# EasyEDA Pro project ProDocument_PCB1_2024-05-18.epro

# Board PCB1
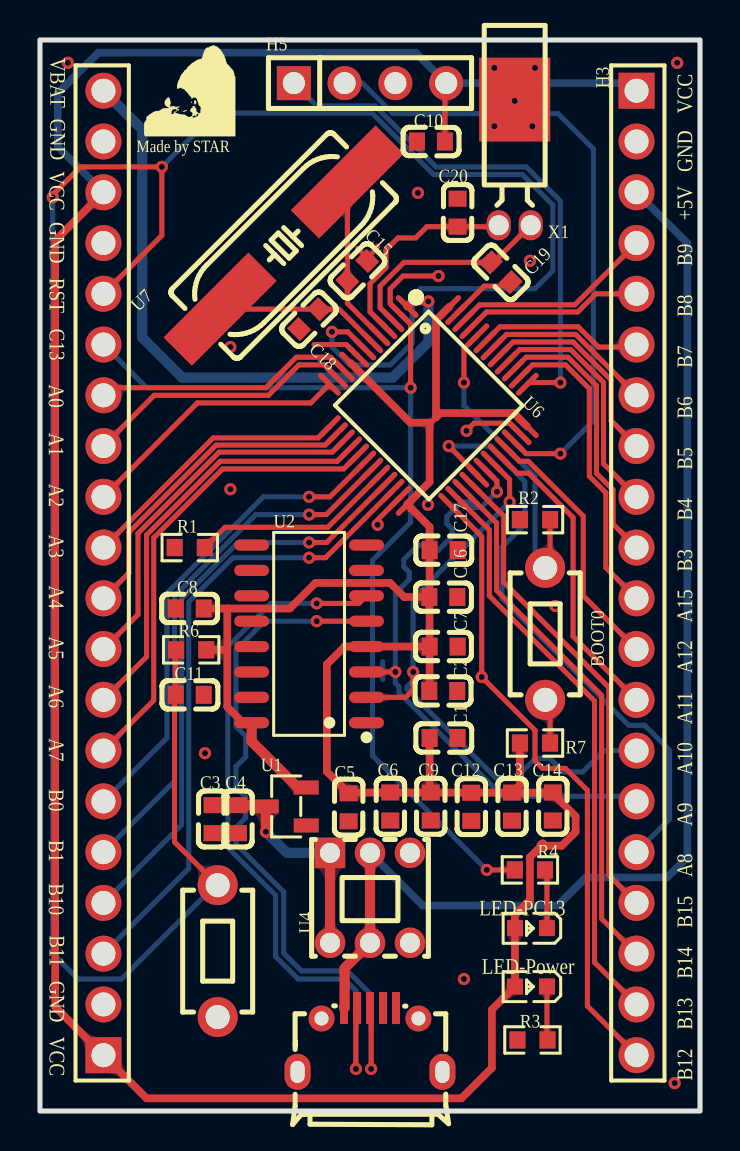
[diagram p0: board, top side]
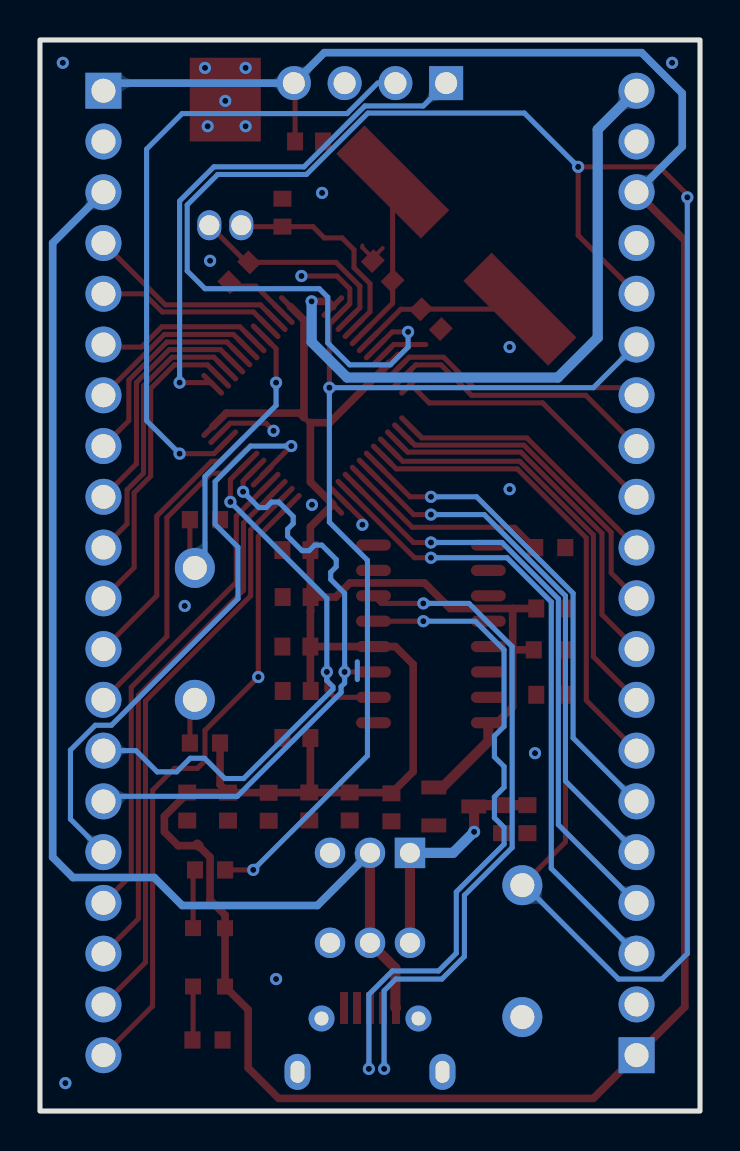
[diagram p1: board, bottom side, seen from below]

Outline 33.02 x 53.59 mm; copper layers: Top Layer, Bottom Layer. Coordinates in mm from the lower left corner of the outline.
Outline path: rectangle 0,53.59 33.02,0
Stack: Top Layer 0.035mm / Dielectric1 1.51mm FR4 er 4.5 / Bottom Layer 0.035mm

## Design rules (mm)
net PC14/RCC_OSC32_IN: DP4
net PC15/RCC_OSC32_OUT: DP4
net PD0/RCC_OSC_IN: DP3
net PD1/RCC_OSC_OUT: DP3
net PA9/MCU_USART1_TX: DP2
net PA10/MCU_USART1_RX: DP2
net $1N8327: DP1
net $1N8354: DP1
template: JLCPCB Capability(Two Layers Board)
spacing copperThickness1oz (default): track to track 0.102, other pairs 0.152 to 0.3
spacing copperThickness2oz: track to track 0.203, other pairs 0.152 to 0.3
track width copperThickness1oz (default): min 0.127, default 0.254, max 2.54
track width copperThickness2oz: min 0.203, default 0.254, max 2.54
differential pair differentialPair (default): width min 0.127, default 0.254, max 2.54; gap min 0.152, default 0.152
via viaSize (default): diameter min 0.5, default 0.61, max 10; hole min 0.3, default 0.305, max 6.3

## Placement (name value [footprint] x y rotation side)
BOOT0  YTS-B011-1A  [SW-TH_L6.1-W3.5-P6.60-LS8.0]  25.27 23.88 90 top
C1  4.7uF  [C0603]  20.19 18.67 180 top
C2  -  [C0603]  20.18 21.02 0 top
C3  10uF  [C0603]  8.64 14.61 270 top
C4  1uF  [C0603]  9.91 14.61 270 top
C5  1uF  [C0603]  15.44 15.2 270 top
C6  0.1uF  [C0603]  17.53 15.24 270 top
C7  0.1uF  [C0603]  20.19 23.24 0 top
C8  0.1uF  [C0603]  7.49 25.15 0 top
C9  -  [C0603]  19.55 15.24 270 top
C10  0.1uF  [C0603]  19.56 48.51 180 top
C11  0.1uF  [C0603]  7.49 20.83 180 top
C12  -  [C0603]  21.58 15.22 270 top
C13  -  [C0603]  23.61 15.23 270 top
C14  -  [C0603]  25.65 15.24 270 top
C15  20pF  [C0603]  15.88 42.04 225 top
C16  1uF  [C0603]  20.18 25.72 180 top
C17  0.01uF  [C0603]  20.19 28.07 180 top
C18  20pF  [C0603]  13.46 39.62 45 top
C19  8pF  [C0603]  23.05 41.97 135 top
C20  8pF  [C0603]  20.89 44.95 270 top
H3  2.54-1*20P直针  [HDR-TH_20P-P2.54-V-M-1]  29.84 26.92 270 top
H4  2.54-1*20P直针  [HDR-TH_20P-P2.54-V-M-1]  3.18 26.92 90 top
H5  PZ254V-11-04P  [HDR-TH_4P-P2.54-V-M]  16.51 51.44 0 top
NOREF  -  [Pad_e86686]  23.75 50.61 0 top
R1  10K  [R0603]  7.49 28.19 0 top
R2  10K  [R0603]  24.76 29.59 180 top
R3  660R  [R0603]  24.64 3.56 180 top
R4  660R  [R0603]  24.51 12.06 180 top
R6  10K  [R0603]  7.56 23.08 180 top
R7  10K  [R0603]  24.76 18.42 180 top
U1  XC6206P332MR  [SOT-23-3_L2.9-W1.3-P1.90-LS2.4-BR]  12.32 15.24 0 top
U2  CH340C  [SOP-16_L10.0-W3.9-P1.27-LS6.0-BL]  13.46 23.88 90 top
U3  USB-micro  [MICRO-USB-SMD_MICROXNJ]  16.51 3.56 0 top
U4  5.8 ZSGT  [SW-TH_5.8ZSGT]  16.51 10.67 180 top
U5  Reset  [SW-TH_L6.1-W3.5-P6.60-LS8.0]  8.89 8 270 top
U6  STM32F103C8T6  [LQFP-48_L7.0-W7.0-P0.50-LS9.0-BL]  19.43 35.31 225 top
U7  8MHz  [HC-49SMD_L11.1-W4.8]  12.19 43.31 45 top
U8  LED_POWER  [LED_0603]  24.51 6.22 180 top
U9  LED_PC13  [LED_0603]  24.51 9.14 180 top
X1  32.768kHz  [OSC-TH_BD3.8-P0.50]  23.75 44.32 0 top

## Footprints (pads in the part's own frame, mm; a bottom-side part is the same pattern mirrored in y, then rotated)
C0603
  rect 0.8x0.9 smd: 1(-0.7,0) 2(0.7,0)
HC-49SMD_L11.1-W4.8
  rect 6x2 smd: 1(-4.5,0) 2(4.5,0)
HDR-TH_4P-P2.54-V-M
  rect 1.7x1.7 hole 1.1: 1(-3.81,0)
  round 1.7 hole 1.1: 2(-1.27,0) 3(1.27,0) 4(3.81,0)
HDR-TH_20P-P2.54-V-M-1
  rect 1.8x1.8 hole 1.2: 1(-24.13,0)
  round 1.8 hole 1.2: 2(-21.59,0) 3(-19.05,0) 4(-16.51,0) 5(-13.97,0) 6(-11.43,0) 7(-8.89,0) 8(-6.35,0) 9(-3.81,0) 10(-1.27,0) 11(1.27,0) 12(3.81,0) 13(6.35,0) 14(8.89,0) 15(11.43,0) 16(13.97,0) 17(16.51,0) 18(19.05,0) 19(21.59,0) 20(24.13,0)
LED_0603
  rect 0.8x0.8 smd: 1(-0.851,-0.01) 2(0.75,-0.005)
LQFP-48_L7.0-W7.0-P0.50-LS9.0-BL
  oval 0.27x1.5 smd: 1(-2.75,-4.25) 2(-2.25,-4.25) 3(-1.75,-4.25) 4(-1.25,-4.25) 5(-0.75,-4.25) 6(-0.25,-4.25) 7(0.25,-4.25) 8(0.75,-4.25) 9(1.25,-4.25) 10(1.75,-4.25) 11(2.25,-4.25) 12(2.75,-4.25) 25(2.75,4.25) 26(2.25,4.25) 27(1.75,4.25) 28(1.25,4.25) 29(0.75,4.25) 30(0.25,4.25) 31(-0.25,4.25) 32(-0.75,4.25) 33(-1.25,4.25) 34(-1.75,4.25) 35(-2.25,4.25) 36(-2.75,4.25)
  oval 1.5x0.27 smd: 13(4.25,-2.75) 14(4.25,-2.25) 15(4.25,-1.75) 16(4.25,-1.25) 17(4.25,-0.75) 18(4.25,-0.25) 19(4.25,0.25) 20(4.25,0.75) 21(4.25,1.25) 22(4.25,1.75) 23(4.25,2.25) 24(4.25,2.75) 37(-4.25,2.75) 38(-4.25,2.25) 39(-4.25,1.75) 40(-4.25,1.25) 41(-4.25,0.75) 42(-4.25,0.25) 43(-4.25,-0.25) 44(-4.25,-0.75) 45(-4.25,-1.25) 46(-4.25,-1.75) 47(-4.25,-2.25) 48(-4.25,-2.75)
MICRO-USB-SMD_MICROXNJ
  rect 0.4x1.6 smd: 1(-1.3,1.597) 2(-0.65,1.597) 3(0,1.597) 4(0.65,1.597) 5(1.3,1.597)
  round 1.3 hole 0.7: 6(2.425,1.074) 9(-2.425,1.073)
  oval 1.3x1.8 hole 0.7x1.1: 7(3.625,-1.597) 8(-3.625,-1.597)
OSC-TH_BD3.8-P0.50
  oval 1.2x1.5 hole 1: 1(-0.8,0) 2(0.8,0)
Pad_e86686
  custom 3.556x4.191 smd: 49(0,0)
R0603
  rect 0.806x0.864 smd: 1(-0.753,0) 2(0.753,0)
SOP-16_L10.0-W3.9-P1.27-LS6.0-BL
  oval 0.56x1.745 smd: 1(-4.445,-2.873) 2(-3.175,-2.873) 3(-1.905,-2.873) 4(-0.635,-2.873) 5(0.635,-2.873) 6(1.905,-2.873) 7(3.175,-2.873) 8(4.445,-2.873) 9(4.445,2.873) 10(3.175,2.873) 11(1.905,2.873) 12(0.635,2.873) 13(-0.635,2.873) 14(-1.905,2.873) 15(-3.175,2.873) 16(-4.445,2.873)
SOT-23-3_L2.9-W1.3-P1.90-LS2.4-BR
  rect 1.25x0.7 smd: 1(1,-0.95) 2(1,0.95) 3(-1,0)
SW-TH_5.8ZSGT
  rect 1.524x1.524 hole 1: 1(2,-2.25)
  round 1.524 hole 1: 2(0,-2.25) 3(-2,-2.25) 4(2,2.25) 5(0,2.25) 6(-2,2.25)
SW-TH_L6.1-W3.5-P6.60-LS8.0
  round 2 hole 1.2: 1(-3.3,0) 2(3.3,0)

## Nets
+5V: H3.3 U3.1 U4.2 U4.5
GND: C1.1 C2.2 C3.2 C4.2 C5.2 C6.2 C7.2 C8.1 C9.2 C10.2 C11.1 C12.2 C13.2 C14.2 C15.1 C16.1 C17.1 C18.1 C19.1 C20.1 H3.2 H4.2 H4.17 H4.19 H5.3 NOREF.49 R1.1 R2.2 R3.2 U1.1 U2.1 U3.4 U3.5 U5.2 U6.8 U6.23 U6.35 U6.47
VBAT: H4.20 U6.1
VCC: C1.2 C2.1 C5.1 C6.1 C7.1 C8.2 C9.1 C10.1 C12.1 C13.1 C14.1 C16.2 C17.2 H3.1 H4.1 H4.18 H5.4 R6.1 R7.2 U1.2 U2.4 U2.16 U6.9 U6.24 U6.36 U6.48 U8.2 U9.2
BOOT0: BOOT0.2 R2.1 U6.44
NRST: C11.2 H4.16 R6.2 U5.1 U6.7
PA0: H4.14 U6.10
PA1: H4.13 U6.11
PA2: H4.12 U6.12
PA3: H4.11 U6.13
PA4: H4.10 U6.14
PA5: H4.9 U6.15
PA6: H4.8 U6.16
PA7: H4.7 U6.17
PA8: H3.16 U6.29
PA9/MCU_USART1_TX: H3.15 U2.3 U6.30
PA10/MCU_USART1_RX: H3.14 U2.2 U6.31
PA11: H3.13 U6.32
PA12: H3.12 U6.33
PA13/JTMS/SWDIO: H5.2 U6.34
PA14/JTCK/SWCLK: H5.1 U6.37
PA15: H3.11 U6.38
PB0: H4.6 U6.18
PB1: H4.5 U6.19
PB2/BOOT1: R1.2 U6.20
PB3: H3.10 U6.39
PB4: H3.9 U6.40
PB5: H3.8 U6.41
PB6: H3.7 U6.42
PB7: H3.6 U6.43
PB8: H3.5 U6.45
PB9: H3.4 U6.46
PB10: H4.4 U6.21
PB11: H4.3 U6.22
PB12: H3.20 U6.25
PB13: H3.19 U6.26
PB14: H3.18 U6.27
PB15: H3.17 U6.28
PC13/LED(B): H4.15 R4.2 U6.2
PC14/RCC_OSC32_IN: C19.2 U6.3 X1.2
PC15/RCC_OSC32_OUT: C20.2 U6.4 X1.1
PD0/RCC_OSC_IN: C15.2 U6.5 U7.2
PD1/RCC_OSC_OUT: C18.2 U6.6 U7.1
$1N7601: R3.1 U8.1
$1N7627: R4.1 U9.1
$1N8327: U2.5 U3.3
$1N8354: U2.6 U3.2
$1N13397: BOOT0.1 R7.1
$1N13854: C3.1 C4.1 U1.3 U4.1 U4.4

Pads without a net: U2 7 8 9 10 11 12 13 14 15; U3 6 7 8 9; U4 3 6

## Via types
v1: diameter 0.61, hole 0.305, Top Layer to Bottom Layer, 43 vias

## Routing (per net, layer and track width the routed paths; a pad name or vN(x,y) marks a point on that pad's centre or on a via; arc(x,y) is an arc through that point)
+5V: length 60.6
  Top Layer w0.508: U4.2 U4.5 15.24,7.15 15.24,5.18 U3.1
  Bottom Layer w0.381: H3.3 32.38,43.43 32.38,12.7 31.37,11.68 27.31,11.68 25.91,10.29 19.14,10.29 U4.2
GND: length 13.3
  Top Layer w0.203: 16.37,42.69 15.88,43.18 ; 16.37,42.69 16.89,43.21 16.89,43.31 ; 16.37,42.69 C15.1
  Top Layer w0.254: U6.35 23.5,34.42 21.72,34.42 v1(21.34,34.04) ; U6.23 16.89,29.58 v1(16.89,29.34) ; 20.84,39.9 22.22,41.28 23.34,41.28 23.55,41.48 ; 13.72,38.35 15.32,38.35 U6.8
  Bottom Layer w0.254: 17.15,22.48 17.15,21.59
  vias: v1(1.4,52.45) v1(8.25,17.91) v1(9.53,38.23) v1(9.53,31.11) v1(18.91,45.94) v1(19.41,30.34) v1(21.21,6.6) v1(22.73,52.2) v1(22.73,49.28) v1(23.75,50.55) v1(24.51,42.55) v1(24.63,49.28) v1(24.76,52.2) v1(25.78,25.27) v1(31.75,1.4) v1(31.88,52.45)
VBAT: length 32.2
  Top Layer w0.381: v1(19.43,40.51) 18.63,40.51 U6.1
  Bottom Layer w0.508: H4.20 5.12,49.11 5.12,38.7 7.11,36.7 17.65,36.7 19.43,38.48 v1(19.43,40.51)
VCC: length 205.3
  Top Layer w0.254: 19.49,34.45 19.56,34.45 19.81,34.7 ; H5.4 20.26,51.37 20.26,48.51
  Top Layer w0.381: C9.1 19.49,16 19.49,18.67 ; 9.37,23.09 9.37,20.22 10.16,19.43 U2.16 ; 9.37,23.09 9.36,23.08 R6.1 ; 9.37,23.09 9.37,25.12 ; U6.48 19.81,39.58 19.81,34.7 20.03,34.92 23.7,34.92 U6.36 ; 25.65,15.93 25.65,15.93 25.65,15.89 26.8,14.75 26.8,13.97 26.1,13.28 25.09,13.28 24.51,12.7 24.51,10.56 23.76,9.81 U9.2 U8.2 22.61,5.07 22.61,2.16 21.08,0.63 5.33,0.63 H4.1 0.76,5.21 0.76,43.56 H4.18 ; 25.65,15.93 23.61,15.93 24.01,16.33 R7.2 ; 25.65,15.93 C14.1 ; 9.37,25.12 9.35,25.15 8.19,25.15 ; 9.37,25.12 9.39,25.15 12.5,25.15 13.78,26.42 17.52,26.42 18.22,25.72 C16.2 19.49,25.73 19.49,29.23 U6.24 19.49,31.48 19.49,34.45 19.49,34.44 18.52,34.44 U6.9 ; 19.48,25.72 19.48,25.01 19.49,25 19.49,23.24 ; 19.49,23.24 U2.4 15.24,23.24 14.35,22.35 14.35,16.99 C5.1 15.47,15.93 23.61,15.93 ; 19.49,23.24 19.49,21.03 C2.1
  Top Layer w0.508: 25.09,13.28 25.15,13.33 ; U2.16 10.59,18.49 12.89,16.19 U1.2
  Bottom Layer w0.381: H4.18 0.89,48.26 0.89,50.93 2.92,52.96 18.8,52.96 H5.4 29.46,51.44 H3.1
BOOT0: length 16.2
  Top Layer w0.254: BOOT0.2 25.52,27.42 R2.1 ; v1(21.21,36.45) 21.21,38.15 21.91,38.84
  Bottom Layer w0.254: v1(21.21,36.45) 21.21,35.31 24.76,31.75 24.76,27.68 BOOT0.2
NRST: length 118.3
  Top Layer w0.254: H4.16 6.1,43.81 v1(6.1,47.24) 2.03,47.24 0.63,45.85 v1(0.63,45.72) ; v1(14.6,38.99) 15.39,38.99 16.25,38.13 ; R6.2 6.79,23.06 C11.2 6.73,20.77 6.73,13.46 U5.1
  Bottom Layer w0.254: v1(6.1,47.24) 8.79,49.94 16.62,49.94 19.69,46.86 24.13,46.86 25.65,45.34 25.65,42.04 24.76,41.15 19.05,41.15 18.62,40.72 18.62,38.44 17.53,37.34 15.49,37.34 14.6,38.23 v1(14.6,38.99) ; U5.1 8.77,11.3 4.08,6.6 1.9,6.6 0.63,7.87 v1(0.63,45.72)
PA0: length 13.1
  Top Layer w0.254: H4.14 3.56,36.19 11.31,36.19 12.83,37.72 14.54,37.72 U6.10
PA1: length 13.6
  Top Layer w0.254: H4.13 5.72,35.81 11.43,35.81 12.96,37.34 14.22,37.34 14.84,36.72
PA2: length 13.6
  Top Layer w0.254: H4.12 7.87,35.43 13.55,35.43 14.48,36.37
PA3: length 13.8
  Top Layer w0.254: H4.11 8.66,33.68 13.92,33.68 U6.13
PA4: length 16.3
  Top Layer w0.254: H4.10 4.44,26.92 4.44,28.96 8.81,33.32 14.27,33.33 14.84,33.89
PA5: length 18.7
  Top Layer w0.254: U6.15 14.62,32.97 8.96,32.97 4.9,28.91 4.9,24.84 H4.9
PA6: length 21.2
  Top Layer w0.254: H4.8 5.33,22.73 5.33,28.83 9.02,32.51 14.87,32.51 U6.16
PA7: length 23.6
  Top Layer w0.254: U6.17 15.19,32.13 9.14,32.13 5.69,28.68 5.69,20.55 H4.7
PA8: length 30.3
  Top Layer w0.254: v1(20.45,33.27) 21.91,31.82 21.91,31.77
  Bottom Layer w0.254: v1(20.45,33.27) 22.48,33.27 24.26,31.5 24.26,29.36 23.11,28.21 23.11,25.64 29.45,19.3 30.25,19.3 31.5,18.06 31.5,14.61 H3.16
PA9/MCU_USART1_TX: length 31.7
  Top Layer w0.254: v1(22.86,30.99) 22.86,31.52 U6.30 ; v1(17.78,21.97) U2.3
  Bottom Layer w0.254: v1(22.86,30.99) 22.07,30.2 21.71,30.2 21.43,30.47 21.07,30.47 20.35,29.75 20.35,29.39 20.63,29.12 20.63,28.76 19.91,28.04 19.55,28.04 19.28,28.32 18.92,28.32 18.2,27.6 18.2,27.24 18.48,26.96 18.48,26.6 17.78,25.91 v1(17.78,21.97) 17.78,21.41 17.96,21.23 17.96,20.94 23.15,15.75 29.75,15.75 29.84,15.66 H3.15
PA10/MCU_USART1_RX: length 31.7
  Top Layer w0.254: v1(18.67,21.97) 18.67,21.08 18.29,20.7 16.33,20.7 ; 22.61,32.48 23.5,31.59 v1(23.5,30.48)
  Bottom Layer w0.254: H3.14 28.22,18.03 27.15,16.97 26.19,16.97 25.5,17.65 24.79,17.65 23.77,16.64 22.83,16.64 18.36,21.11 18.36,21.23 18.67,21.54 v1(18.67,21.97) 18.67,25.65 v1(23.5,30.48)
PA11: length 15.4
  Top Layer w0.254: U6.32 23.88,31.92 24.45,31.92 26.67,29.69 26.67,23.75 H3.13
PA12: length 13
  Top Layer w0.254: H3.12 27.18,25.78 27.18,29.77 24.43,32.51 23.99,32.51 U6.33
PA13/JTMS/SWDIO: length 32.4
  Top Layer w0.254: v1(26.03,32.89) 24.32,32.89 U6.34
  Bottom Layer w0.254: v1(26.03,32.89) 27.69,34.54 27.69,48.13 25.91,49.91 17.65,49.91 16.13,51.44 H5.2
PA14/JTCK/SWCLK: length 26.6
  Top Layer w0.254: 24.38,36.37 24.46,36.45 v1(26.03,36.45)
  Bottom Layer w0.254: v1(26.03,36.45) 26.03,45.53 24.32,47.24 19.81,47.24 16.76,50.29 13.84,50.29 H5.1
PA15: length 15.7
  Top Layer w0.254: H3.11 28.31,27.19 28.31,30.94 27.48,31.77 27.48,36.15 26.29,37.34 24.65,37.34 U6.38
PB0: length 24.3
  Top Layer w0.254: 16.25,32.48 14.51,30.73 v1(13.46,30.73)
  Bottom Layer w0.254: H4.6 6.35,18.67 6.35,25.91 11.18,30.73 v1(13.46,30.73)
PB1: length 26.8
  Top Layer w0.254: U6.19 14.32,29.84 v1(13.46,29.84)
  Bottom Layer w0.254: H4.5 6.73,16.51 6.73,25.78 10.79,29.84 v1(13.46,29.84)
PB2/BOOT1: length 10.2
  Top Layer w0.254: R1.2 9.26,29.21 14.4,29.21 U6.20
PB3: length 14
  Top Layer w0.254: H3.10 28.67,29.37 28.67,31.09 27.84,31.91 27.84,36.3 26.42,37.72 24.32,37.72 23.67,37.07
PB4: length 12.2
  Top Layer w0.254: U6.40 23.99,38.1 26.55,38.1 28.19,36.45 28.19,32.39 H3.9
PB5: length 10.5
  Top Layer w0.254: H3.8 28.57,34.54 28.57,36.58 26.67,38.48 23.67,38.48 U6.41
PB6: length 8.8
  Top Layer w0.254: 22.61,38.14 23.34,38.86 26.8,38.86 H3.7
PB7: length 8.4
  Top Layer w0.254: U6.43 23.01,39.24 26.92,39.24 27.94,38.23 29.72,38.23 H3.6
PB8: length 9
  Top Layer w0.254: H3.5 27.81,40.89 26.9,39.98 22.34,39.98 U6.45
PB9: length 10.3
  Top Layer w0.254: 21.2,39.55 21.99,40.34 26.75,40.34 H3.4
PB10: length 29.5
  Top Layer w0.254: v1(13.46,28.45) 14.34,28.45 U6.21
  Bottom Layer w0.254: H4.4 7.09,14.33 7.09,25.63 9.91,28.45 v1(13.46,28.45)
PB11: length 31.9
  Top Layer w0.254: U6.22 14.28,27.69 v1(13.46,27.69)
  Bottom Layer w0.254: H4.3 7.44,12.14 7.44,25.48 9.65,27.69 v1(13.46,27.69)
PB12: length 32.1
  Top Layer w0.254: U6.25 22.1,28.75 v1(22.1,21.72) 24.76,19.05 24.76,17.53 25.15,17.14 26.29,17.14 27.39,16.05 27.39,5.25 H3.20
PB13: length 29.1
  Top Layer w0.254: H3.19 27.74,7.44 27.74,20.52 22.48,25.78 22.48,29.08 20.85,30.71
PB14: length 26.8
  Top Layer w0.254: H3.18 28.1,9.62 28.1,20.8 22.84,26.06 22.84,29.42 21.2,31.06
PB15: length 24.4
  Top Layer w0.254: 21.55,31.42 23.2,29.77 23.2,26.46 28.46,21.2 28.46,11.8 H3.17
PC13/LED(B): length 53
  Top Layer w0.254: U6.2 17.52,40.4 17.52,41.14 18.16,41.78 v1(19.94,41.78) ; v1(18.54,36.19) 18.54,39.38 18.02,39.9 ; v1(22.35,12.06) 23.76,12.06
  Bottom Layer w0.254: H4.15 5.33,36.19 v1(18.54,36.19) 18.54,29.46 16.64,27.56 16.64,17.78 v1(22.35,12.06)
PC14/RCC_OSC32_IN: length 10.8
  Top Layer w0.254: U6.3 17.02,40.19 17.02,41.28 18.21,42.47 22.69,42.47 X1.2
PC15/RCC_OSC32_OUT: length 10.7
  Top Layer w0.254: X1.1 22.88,44.25 C20.2 19.36,44.25 18.8,43.69 17.91,43.69 17.31,43.09 17.31,42.2 16.51,41.4 16.51,39.99 U6.4
PD0/RCC_OSC_IN: length 8.3
  Top Layer w0.254: U6.5 15.38,40.42 C15.2 15.38,46.48 U7.2
PD1/RCC_OSC_OUT: length 8.3
  Top Layer w0.254: 9.01,40.12 13.95,40.12 13.96,40.12 14.97,40.12 U6.6
$1N7601: length 2.6
  Top Layer w0.254: 25.36,3.65 U8.1
$1N7627: length 2.9
  Top Layer w0.254: U9.1 25.36,11.97 25.27,12.06
$1N8327: length 36.1
  Top Layer w0.254: v1(16.57,2.11) 16.57,5.1 U3.3 ; U2.5 v1(13.84,24.51)
  Bottom Layer w0.254: v1(16.57,2.11) 16.57,5.83 15.39,7.01 13.08,7.01 12.19,7.9 12.19,10.96 9.8,13.35 9.8,14.19 10.29,14.67 10.29,15.72 9.8,16.2 9.8,17.24 10.29,17.72 10.29,18.76 9.8,19.25 9.8,23.07 11.24,24.51 v1(13.84,24.51)
$1N8354: length 36.2
  Top Layer w0.254: U3.2 15.8,5.1 v1(15.8,2.11) ; v1(13.84,25.4) 15.95,25.4 U2.6
  Bottom Layer w0.254: v1(13.84,25.4) 11.56,25.4 9.4,23.24 9.4,13.18 11.79,10.8 11.79,7.73 12.91,6.6 15.22,6.6 15.8,6.02 v1(15.8,2.11)
$1N13397: length 2.8
  Top Layer w0.254: R7.1 25.52,20.17 24.76,20.92
$1N13854: length 12.1
  Top Layer w0.508: v1(11.3,13.97) 11.3,15.22 U1.3 11.25,15.31 C4.1 C3.1 ; 14.51,8.42 14.51,12.92
  Bottom Layer w0.508: 14.51,12.92 12.35,12.92 v1(11.3,13.97)

## Copper pours and planes (outline as drawn; the poured copper is in the pictures)
GND on Top Layer: -16.89,61.34 55.63,61.34 55.63,-5.84 -16.89,-5.84
GND on Bottom Layer: -17.53,64.64 55.24,64.64 55.24,-5.08 -17.53,-5.08

Small or netless copper shapes (teardrops, artwork), in the pictures only: 214 on Top Layer, 71 on Bottom Layer

## Text on the board
Top Silkscreen Layer: Made by STAR | LED-PC13 | LED-Power | VCC | B9 | B8 | B7 | B6 | B5 | B4 | B3 | A15 | A12 | A11 | A10 | A9 | A8 | B15 | B14 | B13 | B12 | GND | +5V | A0 | A1 | A2 | A3 | A4 | A5 | A6 | A7 | B0 | B1 | B10 | RST | C13 | B11 | VBAT
